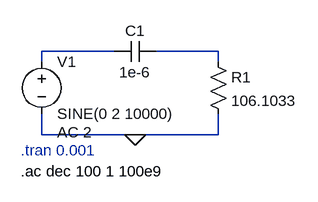
[diagram p0: schematic RC filter.asc]
RC filter.asc, the LTspice schematic file:
Version 4.1
SHEET 1 880 680
WIRE 144 96 32 96
WIRE 304 96 208 96
WIRE 32 112 32 96
WIRE 304 112 304 96
WIRE 32 224 32 192
WIRE 176 224 32 224
WIRE 304 224 304 192
WIRE 304 224 176 224
FLAG 176 224 0
SYMBOL res 288 96 R0
SYMATTR InstName R1
SYMATTR Value 106.1033
SYMBOL cap 208 80 R90
WINDOW 0 0 32 VBottom 2
WINDOW 3 32 32 VTop 2
SYMATTR InstName C1
SYMATTR Value 1e-6
SYMBOL voltage 32 96 R0
WINDOW 123 24 124 Left 2
WINDOW 39 0 0 Left 0
SYMATTR InstName V1
SYMATTR Value SINE(0 2 10000)
SYMATTR Value2 AC 2
TEXT 0 248 Left 2 ;.tran 0.001
TEXT 0 280 Left 2 !.ac dec 100 1 100e9

The netlist it stands for:
* RC filter.asc
R1 N002 0 106.1033
C1 N002 N001 1e-6
V1 N001 0 SINE(0 2 10000) AC 2
* .tran 0.001
.ac dec 100 1 100e9
.backanno
.end